# EAGLE schematic Board roomba final (EAGLE 9.6.2)
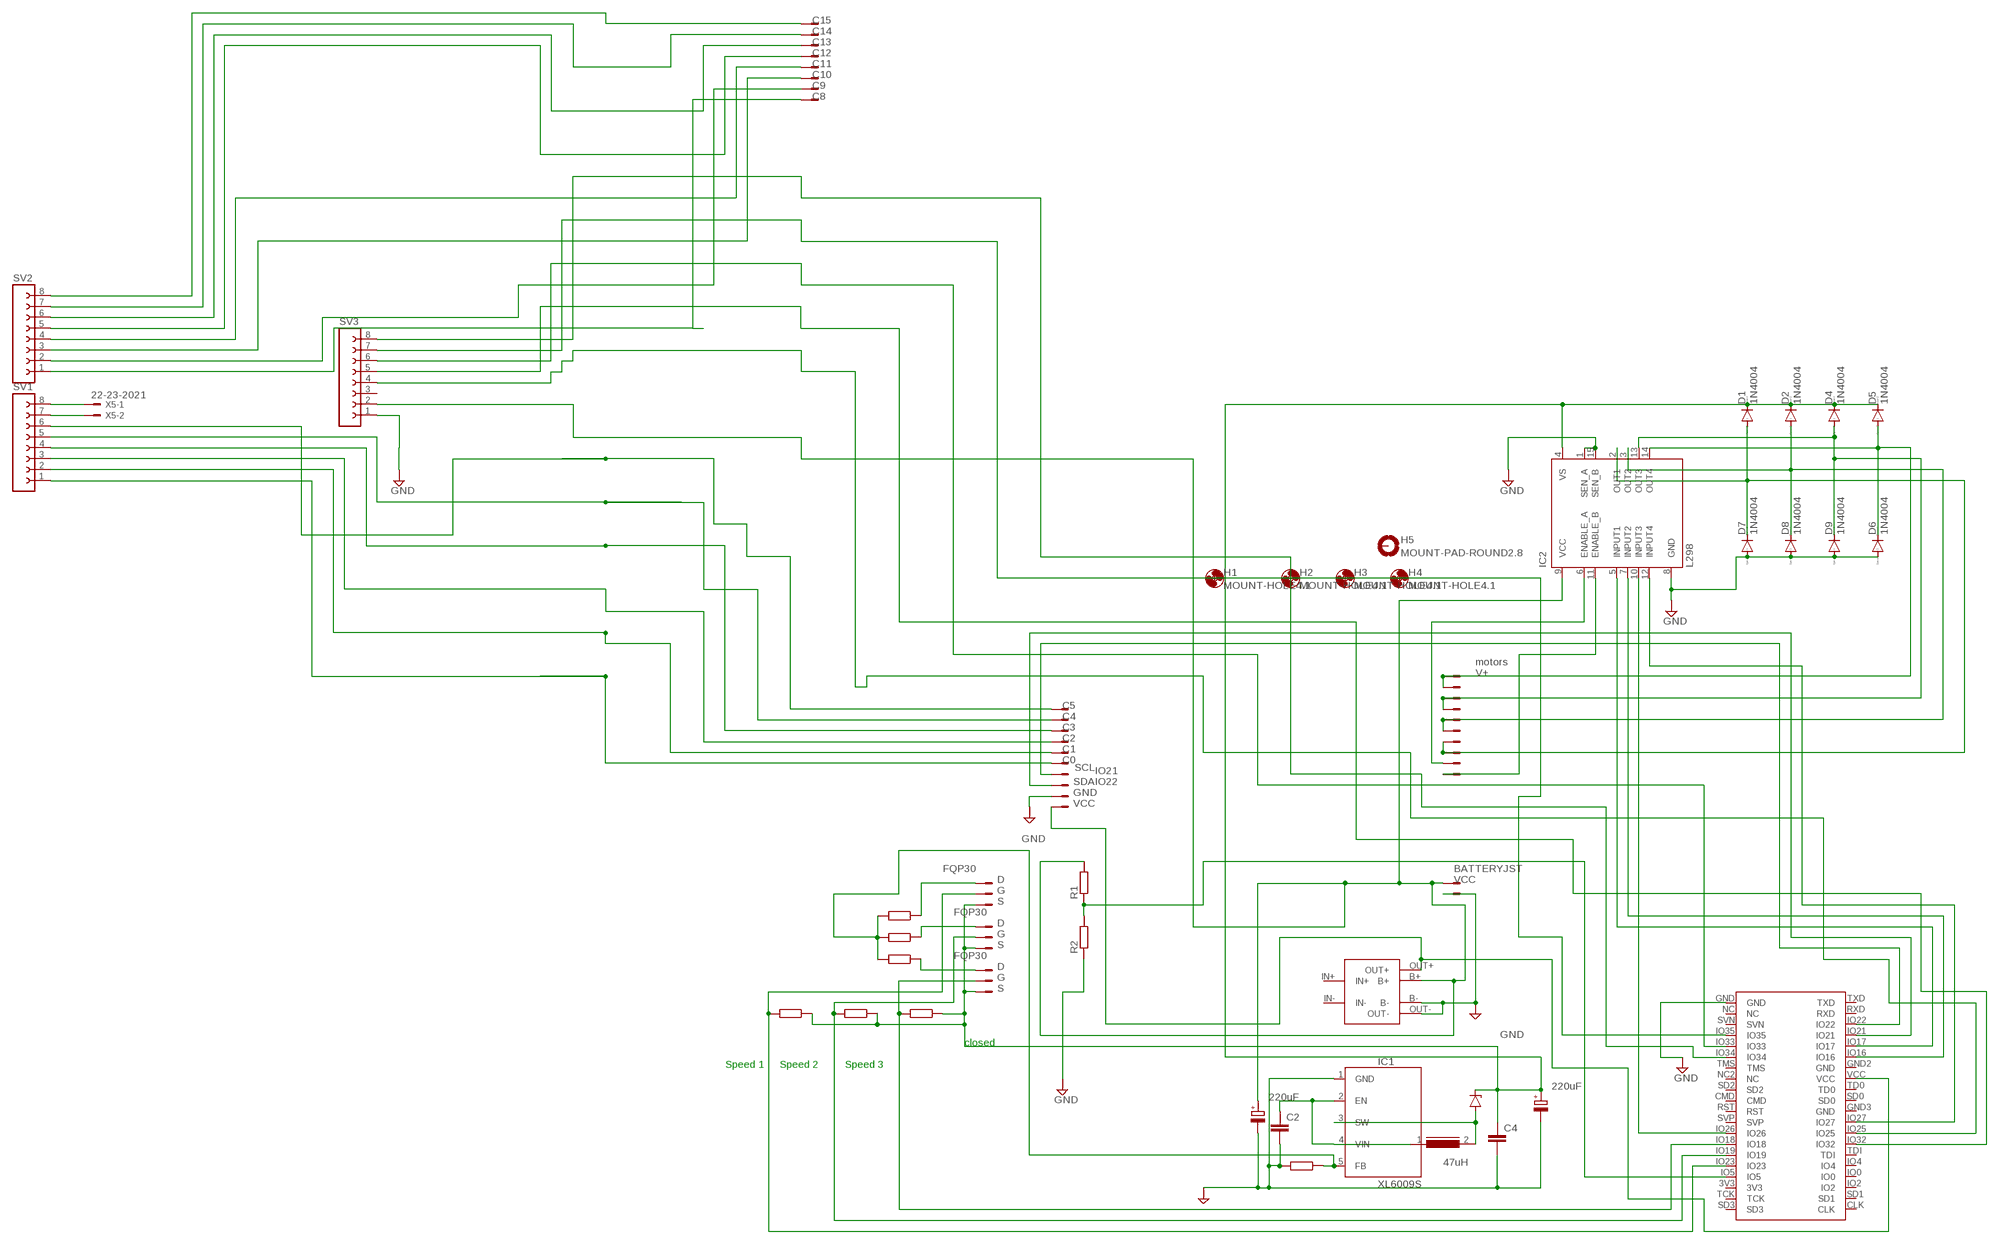
[diagram p0: schematic, sheet 1]

## Parts
C1  CPOL-EUE2.5-7  [E2,5-7]
C2  C2,5-3  [C2.5-3]
C3  CPOL-EUE2.5-7  [E2,5-7]
C4  C2,5-3  [C2.5-3]
D1  1N4004  [DO41-10]
D2  1N4004  [DO41-10]
D3  1N4728  [DO41Z10]
D4  1N4004  [DO41-10]
D5  1N4004  [DO41-10]
D6  1N4004  [DO41-10]
D7  1N4004  [DO41-10]
D8  1N4004  [DO41-10]
D9  1N4004  [DO41-10]
H1  MOUNT-HOLE4.1  [4,1]
H2  MOUNT-HOLE4.1  [4,1]
H3  MOUNT-HOLE4.1  [4,1]
H4  MOUNT-HOLE4.1  [4,1]
H5  MOUNT-PAD-ROUND2.8  [2,8-PAD]
IC1  XL6009S  [TO263-5]
IC2  L298  [MULTIWATT-15]
L1  DR127  [DR127]
R1  R-EU_0207/10  [0207/10]
R2  R-EU_0207/10  [0207/10]
R4  R-EU_0207/10  [0207/10]
R5  R-EU_0207/10  [0207/10]
R6  R-EU_0207/10  [0207/10]
R7  R-EU_0207/10  [0207/10]
R8  R-EU_0207/10  [0207/10]
R9  R-EU_0207/10  [0207/10]
R10  R-EU_0207/10  [0207/10]
SV1  FE08W  [FE08W]
SV2  FE08W  [FE08W]
SV3  FE08W  [FE08W]
U$1  TP4056  [TP4056]
U$2  MH-ET_ESP32_D1_MINI  [MH-ET_ESP32_D1_MINI]
X1  22-23-2101  [22-23-2101]
X2  22-23-2031  [22-23-2031]
X3  22-23-2031  [22-23-2031]
X4  22-23-2101  [22-23-2101]
X5  22-23-2021  [22-23-2021]
X6  22-23-2081  [22-23-2081]
X7  22-23-2021  [22-23-2021]
X9  22-23-2031  [22-23-2031]

## Nets
GND: C1.- C2.2 C3.- C4.2 D6.A D7.A D8.A D9.A IC1.1(GND) IC2.1(SEN_A) IC2.8(GND) IC2.15(SEN_B) R2.1 R4.2 SV3.1 U$1.B- U$1.OUT- U$2.GND X1.9 X7.2
N$1: U$1.OUT+ U$2.VCC X1.10
N$2: SV3.5 U$2.IO32
N$3: SV3.6 U$2.IO33
N$4: IC1.5(FB) R4.1 R5.2 R6.2 R7.2
N$5: R7.1 X3.1
N$6: R6.1 X2.1
N$7: R5.1 X9.1
N$8: R8.2 U$2.IO18 X3.2
N$9: R9.2 U$2.IO19 X2.2
N$10: R10.2 U$2.IO23 X9.2
N$11: U$2.IO21 X1.8
N$12: C2.1 IC1.2(EN) IC1.4(VIN) L1.1
N$13: IC2.6(ENABLE_A) X4.9
N$14: SV1.7 X5.2
N$15: IC2.5(INPUT1) U$2.IO17
N$16: C3.+ C4.1 D1.C D2.C D3.C D4.C D5.C IC2.4(VS) R8.1 R9.1 R10.1 X2.3 X3.3 X9.3
N$17: D3.A IC1.3(SW) L1.2
N$18: IC2.7(INPUT2) U$2.IO16
N$19: IC2.10(INPUT3) U$2.IO26
N$20: IC2.12(INPUT4) U$2.IO27
N$21: U$2.IO22 X1.7
N$22: IC2.11(ENABLE_B) X4.10
N$23: R1.1 R2.2 U$2.IO5
N$25: SV1.8 X5.1
N$26: D4.A D9.C IC2.13(OUT3) X4.3 X4.4
N$27: D5.A D6.C IC2.14(OUT4) X4.1 X4.2
N$28: SV2.1 X6.8
N$29: D2.A D8.C IC2.3(OUT2) X4.5 X4.6
N$30: D1.A D7.C IC2.2(OUT1) X4.7 X4.8
N$31: SV1.1 X1.6
N$32: SV1.2 X1.5
N$33: SV1.3 X1.4
N$35: SV1.5 X1.2
N$36: SV1.6 X1.1
N$37: C1.+ IC2.9(VCC) R1.2 SV3.2 U$1.B+ X7.1
N$38: SV3.7 U$2.IO35
N$39: SV3.4 U$2.IO25
N$40: SV2.2 X6.7
N$41: SV2.3 X6.6
N$43: SV2.4 X6.5
N$44: SV1.4 X1.3
N$45: SV2.8 X6.1
N$46: SV2.7 X6.2
N$47: SV2.6 X6.3
N$48: SV2.5 X6.4
N$50: SV3.8 U$2.IO34
Unconnected: H5.B2,8(MOUNT) SV3.3 U$1.IN+ U$1.IN- U$2.3V3 U$2.CLK U$2.CMD U$2.GND2(GND) U$2.GND3(GND) U$2.IO0 U$2.IO2 U$2.IO4 U$2.NC U$2.NC2(NC) U$2.RST U$2.RXD U$2.SD0 U$2.SD1 U$2.SD2 U$2.SD3 U$2.SVN U$2.SVP U$2.TCK U$2.TD0 U$2.TDI U$2.TMS U$2.TXD

## Notes on the sheet
- closed
- Speed 1 | Speed 2 | Speed 3

## Library data of the parts
C1 C3 = rcl:CPOL-EU: POLARIZED CAPACITOR, European symbol; SPICEPREFIX: 220uF
C2 C4 = capacitor-wima:C: CAPACITOR naming: grid - package width
D1 D2 D4-D9 = diode:1N4004: DIODE general purpose rectifier, 1 A
D3 = diode:1N4728: Z DIODE 3.3 V, 1W, 5 percent
H1-H4 = holes:MOUNT-HOLE: MOUNTING HOLE with drill center marker
H5 = holes:MOUNT-PAD-ROUND: MOUNTING PAD, round
IC1 = XL6009-TO263:XL6009: XL6009. 400KHz 60V 4A Switching Current Boost / Buck-Boost / Inverting DC/DC Converter. Created By: Manash Jyoti Deka. Github: https://github.com/mjdeka
IC2 = st-microelectronics:L298: DUAL FULL-BRIDGE DRIVER; MPN: L298N; OC_FARNELL: 1589425; OC_NEWARK: 32M1527
L1 = inductors:DR127: High Power Density, High Efficiency, Shielded Inductors Source: coiltronics_dr_series.pdf; 47: 47uH; SPICEPREFIX: L
R1 R2 R4-R10 = rcl:R-EU_: RESISTOR, European symbol; SPICEPREFIX: R
SV1-SV3 = con-lsta:FE08W: FEMALE HEADER; OC_FARNELL: unknown; OC_NEWARK: unknown
U$1 = 32teeth - TP4056 Module:TP4056
U$2 = MH-ET_ESP32_D1_MINI:MH-ET_ESP32_D1_MINI
X1 = con-molex:22-23-2101: .100" (2.54mm) Center Header - 10 Pin; GROUND: GND; IO21: IO21; IO22: IO22; MF: MOLEX; MPN: 22-23-2101; OC_FARNELL: 1756828; OC_NEWARK: 94C0765; SCL: SCL; VCC: VCC
X2 X3 X9 = con-molex:22-23-2031: .100" (2.54mm) Center Header - 3 Pin; MF: MOLEX; MPN: 22-23-2031; OC_FARNELL: 1462950; OC_NEWARK: 30C0862
X4 = con-molex:22-23-2101: .100" (2.54mm) Center Header - 10 Pin; 9V: V+; MF: MOLEX; MPN: motors; OC_FARNELL: 1756828; OC_NEWARK: 94C0765
X5 X7 = con-molex:22-23-2021: .100" (2.54mm) Center Header - 2 Pin; MF: MOLEX; MPN: 22-23-2021; OC_FARNELL: 1462926; OC_NEWARK: 25C3832
X6 = con-molex:22-23-2081: .100" (2.54mm) Center Header - 8 Pin; MF: MOLEX; MPN: 22-23-2081; OC_FARNELL: 1756826; OC_NEWARK: 01C7592